# EAGLE schematic faster-charger-sync (EAGLE 7.1.0)
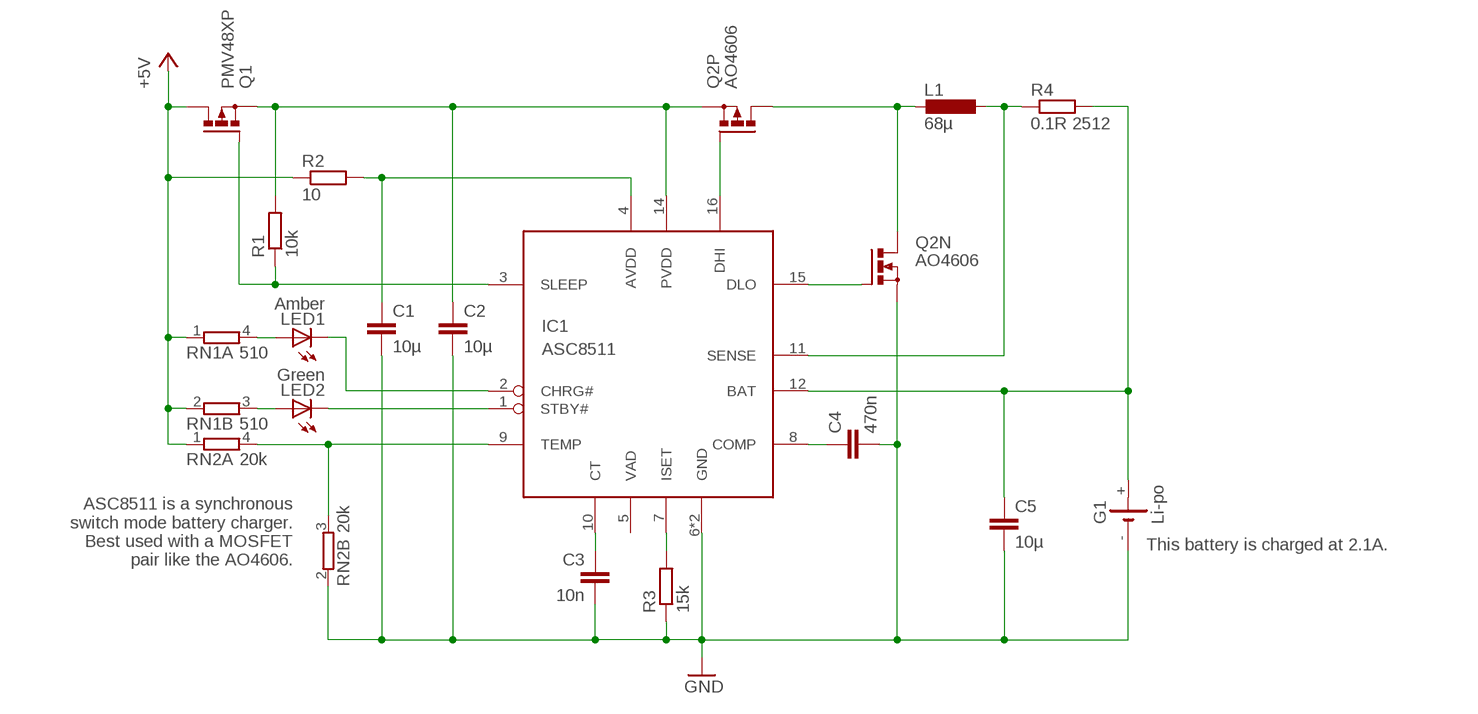
[diagram p0: schematic, sheet 1]

## Parts
C1  10µ  C-EUC0805  [C0805]
C2  10µ  C-EUC0805  [C0805]
C3  10n  C-EUC0603  [C0603]
C4  470n  C-EUC0603  [C0603]
C5  10µ  C-EUC0805  [C0805]
G1  Li-po  SL-150-1/2AA/PR  [SL-150-1/2AA/PR]
IC1  ASC8511  [TSSOP16]
L1  68µ  L-EUL2825P  [L2825P]
LED1  Amber  LEDCHIP-LED0805  [CHIP-LED0805]
LED2  Green  LEDCHIP-LED0805  [CHIP-LED0805]
Q1  PMV48XP  [SOT23]
Q2  AO4606  [SO-08M]
R1  10k  R-EU_R0603  [R0603]
R2  10  R-EU_R0603  [R0603]
R3  15k  R-EU_R0603  [R0603]
R4  0.1R 2512  R-EU_R2512  [R2512]
RN1  510  2R-NEXB34V  [EXB34V]
RN2  20k  2R-NEXB34V  [EXB34V]

## Nets
+5V: Q1.3(D) R2.1 RN1.1 RN1.2 RN2.1
GND: C1.2 C2.2 C3.2 C4.2 C5.2 G1.- IC1.6(GND) IC1.13(GND) Q2.1(N:S) R3.1 RN2.2
N$1: IC1.7(ISET) R3.2
N$2: C4.1 IC1.8(COMP)
N$3: C3.1 IC1.10(CT)
N$4: C1.1 IC1.4(AVDD) R2.2
N$5: IC1.16(DHI) Q2.5(P:G)
N$6: IC1.15(DLO) Q2.2(N:G)
N$7: L1.2 Q2.3(P:D) Q2.4(P:D) Q2.7(N:D) Q2.8(N:D)
N$8: C2.1 IC1.14(PVDD) Q1.2(S) Q2.6(P:S) R1.2
N$9: IC1.3(SLEEP) Q1.1(G) R1.1
N$10: IC1.11(SENSE) L1.1 R4.1
N$11: LED1.A RN1.4
N$12: LED2.A RN1.3
N$13: IC1.1(STBY#) LED2.C
N$14: IC1.2(CHRG#) LED1.C
N$15: IC1.9(TEMP) RN2.3 RN2.4
N$16: C5.1 G1.+ IC1.12(BAT) R4.2
Unconnected: IC1.5(VAD)

## Notes on the sheet
- ASC8511 is a synchronous
  switch mode battery charger.
  Best used with a MOSFET
  pair like the AO4606.
- This battery is charged at 2.1A.

## Library data of the parts
C1-C5 = rcl:C-EU: CAPACITOR, European symbol
G1 = battery:SL-150-1/2AA/PR: LI BATTERY Sonnenschein
IC1 = micwl:ASC8511
L1 = rcl:L-EU: INDUCTOR, European symbol
LED1 LED2 = led:LED: LED OSRAM: - CHIPLED LG R971, LG N971, LY N971, LG Q971, LY Q971, LO R971, LY R971 LH N974, LH R974 LS Q976, LO Q976, LY Q976 LO Q996 - Hyper CHIPLED LW Q18S LB Q993, LB Q99A, LB R99A - SideLED LS A670, LO A670, LY A670, LG A670, LP A670 LB A673, LV A673, LT A673, LW A673 LH A674 LY A675 LS A676, LA A676, LO A676, LY A676, LW A676 LS A679, LY A679, LG A679 - Hyper Micro SIDELED® LS Y876, LA Y876, LO Y876, LY Y876 LT Y87S - SmartLED LW L88C, LW L88S LB L89C, LB L89S, LG L890 LS L89K, LO L89K, LY L89K LS L896, LA L896, LO L896, LY L896 - TOPLED LS T670, LO T670, LY T670, LG T670, LP T670 LSG T670, LSP T670, LSY T670, LOP T670, LYG T670 LG T671, LOG T671, LSG T671 LB T673, LV T673, LT T673, LW T673 LH T674 LS T676, LA T676, LO T676, LY T676, LB T676, LH T676, LSB T676, LW T676 LB T67C, LV T67C, LT T67C, LS T67K, LO T67K, LY T67K, LW E67C LS E67B, LA E67B, LO E67B, LY E67B, LB E67C, LV E67C, LT E67C LW T67C LS T679, LY T679, LG T679 LS T770, LO T770, LY T770, LG T770, LP T770 LB T773, LV T773, LT T773, LW T773 LH T774 LS E675, LA E675, LY E675, LS T675 LS T776, LA T776, LO T776, LY T776, LB T776 LHGB T686 LT T68C, LB T68C - Hyper Mini TOPLED® LB M676 - Mini TOPLED Santana® LG M470 LS M47K, LO M47K, LY M47K Source: http://www.osram.convergy.de LUXEON: - LUMILED® LXK2-PW12-R00, LXK2-PW12-S00, LXK2-PW14-U00, LXK2-PW14-V00 LXK2-PM12-R00, LXK2-PM12-S00, LXK2-PM14-U00 LXK2-PE12-Q00, LXK2-PE12-R00, LXK2-PE12-S00, LXK2-PE14-T00, LXK2-PE14-U00 LXK2-PB12-K00, LXK2-PB12-L00, LXK2-PB12-M00, LXK2-PB14-N00, LXK2-PB14-P00, LXK2-PB14-Q00 LXK2-PR12-L00, LXK2-PR12-M00, LXK2-PR14-Q00, LXK2-PR14-R00 LXK2-PD12-Q00, LXK2-PD12-R00, LXK2-PD12-S00 LXK2-PH12-R00, LXK2-PH12-S00 LXK2-PL12-P00, LXK2-PL12-Q00, LXK2-PL12-R00 Source: www.luxeon.com KINGBRIGHT: KA-3528ASYC Source: www.kingbright.com
Q1 = micwl:PMV48XP
Q2 = micwl:AO4606
R1-R4 = rcl:R-EU_: RESISTOR, European symbol
RN1 RN2 = resistor-dil:2R-N: Array Chip Resistor Source: Panasonic; OC_FARNELL: unknown; OC_NEWARK: unknown